# Altium schematic sheet Peripherals.SchDoc
size A3; SheetNumber: 3; SheetTotal: 3
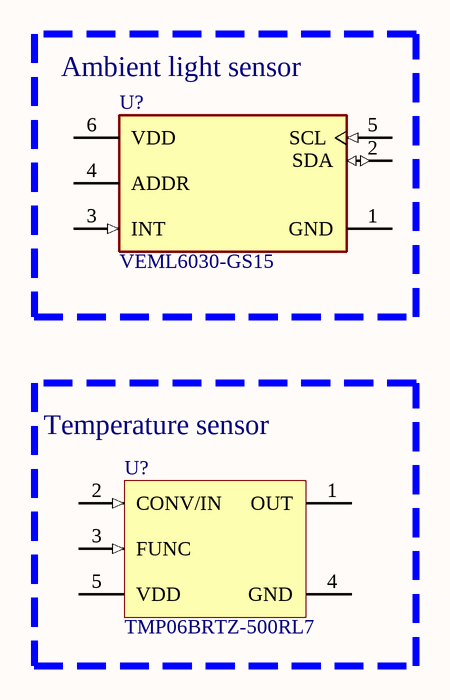
[diagram p0: Peripherals.SchDoc]

## Parts
(Parts that share a designator on the sheet are numbered #1, #2 ... from top to bottom, then left to right.)
U?#1  VEML6030-GS15  [FP-6_550-5348_01-4-MFG]
U?#2  TMP06BRTZ-500RL7  [ADI-RJ-5_L]

## Blocks framed on the sheet
Ambient light sensor: U?#1
Temperature sensor: U?#2

## Nets

Not connected (* = marked no-connect by the designer): U?#1 1(GND) 2(SDA) 3(INT) 4(ADDR) 5(SCL) 6(VDD); U?#2 1(OUT) 2(CONV/IN) 3(FUNC) 4(GND) 5(VDD)

## Library data of the parts
U?#1 = CMP-00030-75380597-1: VEML6030-GS15 Light to Digital Ambient Light Sensor Digital 3.3V 6-Pin T/R; RoHS: Non-Compliant; NexarPartId: 75380597
U?#2 = CMP-0886-00072-1: +/-0.5 degrees C Accurate PWM Temperature Sensor, 3 to 5.5 V Supply, Industrial, 5-pin SOT23 (RJ-5), Reel; Manufacturer: Analog Devices; Supply Voltage Range: 3 to 5.5 V; ComponentLink3Description: Package Specification; DatasheetVersion: Rev. C; PackageDescription: 5-Pin Small Outline Transistor Package, Body 2.9 x 1.6 mm, Pitch 0.95 mm; ComponentLink2Description: Datasheet; ComponentLink4Description: Product URL; PackageVersion: 121608-A , 12/2008; Packing: Reel; ComponentLink1Description: Manufacturer URL; PackageReference: RJ-5; ComponentLink2URL: http://www.analog.com/static/imported-files/data_sheets/TMP05_06.pdf; Code_JEDEC: MO-178-AA; ComponentLink1URL: http://www.analog.com/en/index.html; ComponentLink4URL: http://www.analog.com/en/mems-sensors/digital-temperature-sensors/tmp06/products/product.html; Mounting Technology: Surface Mount; PartNumber: TMP06BRTZ-500RL7; ComponentLink3URL: http://www.analog.com/static/imported-files/packages/PKG_PDF/SOT-23(RJ)/RJ_5.pdf